# EAGLE design esp8266_programmer (EAGLE 9.2.1)
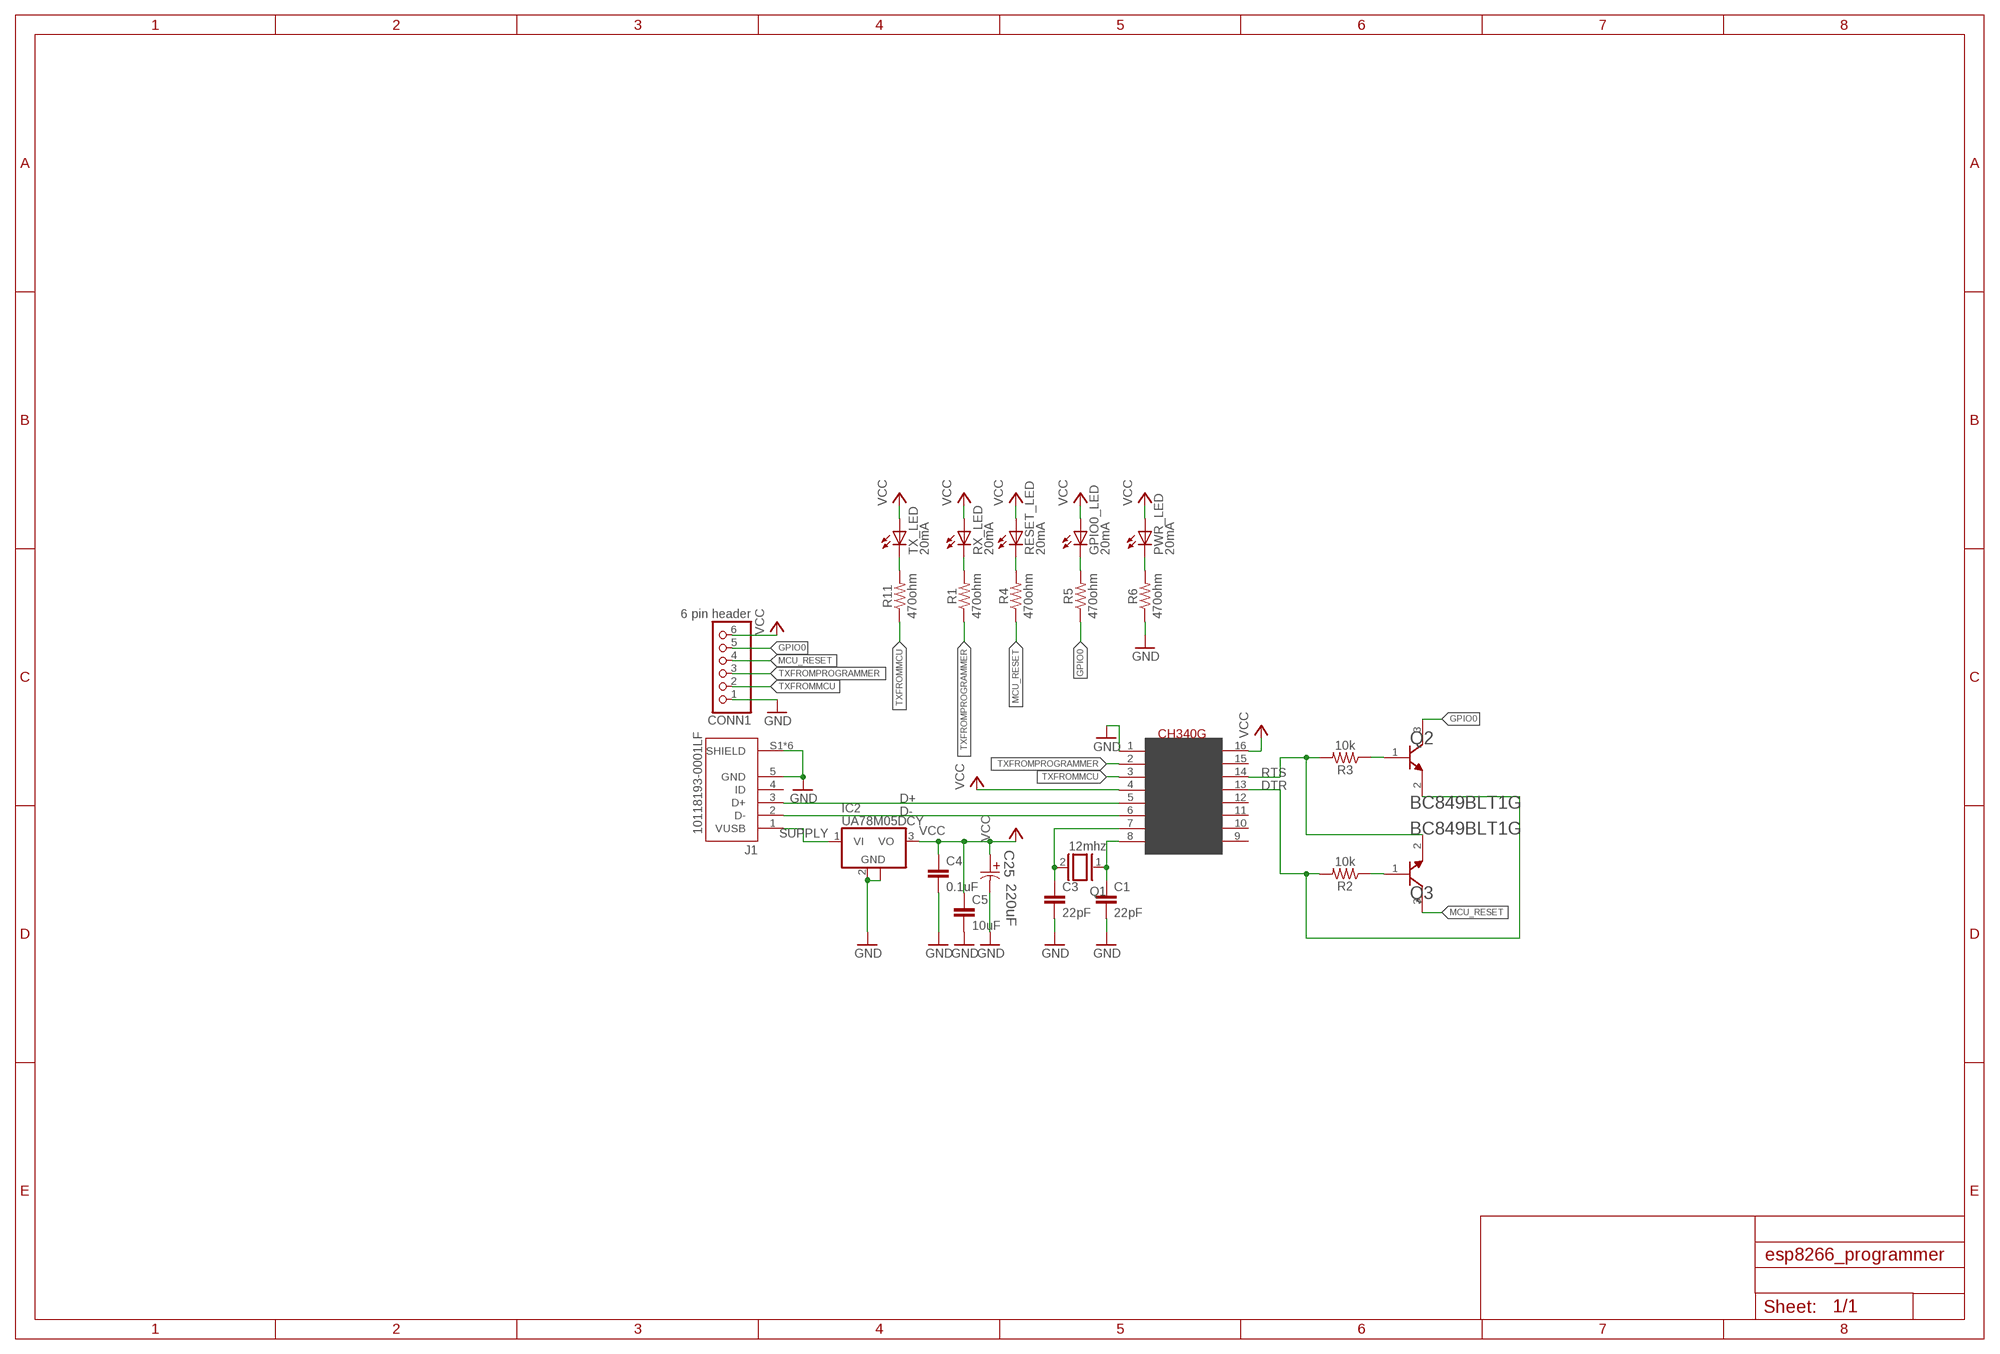
[diagram p0: schematic, sheet 1]

## Parts
C1  22pF  C-EUC0603  [C0603]
C3  22pF  C-EUC0603  [C0603]
C4  0.1uF  C-EUC0603  [C0603]
C5  10uF  C-EUC0603  [C0603]
C25  220uF  EEE-FK1C471P-CASE-F  [CAPAE830X1050N]
CONN1  6 pin header  PINHD-1X6  [1X06]
GPIO0_LED  20mA  LEDCHIP-LED0603  [CHIP-LED0603]
IC2  UA78M05DCY  [SOT223]
J1  10118193-0001LF  [FCI_10118193-0001LF]
PWR_LED  20mA  LEDCHIP-LED0603  [CHIP-LED0603]
Q1  12mhz  XTAL/S  [QS]
Q2  ON_SEMICONDUCTOR_BC849BLT1GON_SEMICONDUCTOR_BC849BLT1G_0_0  [ON_SEMICONDUCTOR_BC849BLT1G_0]
Q3  ON_SEMICONDUCTOR_BC849BLT1GON_SEMICONDUCTOR_BC849BLT1G_0_0  [ON_SEMICONDUCTOR_BC849BLT1G_0]
R1  470ohm  10KOHM-0603-1/10W-1%  [0603]
R2  10k  10KOHM-0603-1/10W-1%  [0603]
R3  10k  10KOHM-0603-1/10W-1%  [0603]
R4  470ohm  10KOHM-0603-1/10W-1%  [0603]
R5  470ohm  10KOHM-0603-1/10W-1%  [0603]
R6  470ohm  10KOHM-0603-1/10W-1%  [0603]
R11  470ohm  10KOHM-0603-1/10W-1%  [0603]
RESET_LED  20mA  LEDCHIP-LED0603  [CHIP-LED0603]
RX_LED  20mA  LEDCHIP-LED0603  [CHIP-LED0603]
TX_LED  20mA  LEDCHIP-LED0603  [CHIP-LED0603]
U$1  CH340G  [SOIC16]

## Nets
CRYSTALIN: C3.1 Q1.2 U$1.7(XI)
CRYSTALOUT: C1.1 Q1.1 U$1.8(XO)
D+: J1.3(D+) U$1.5(D+)
D-: J1.2(D-) U$1.6(D-)
DTR: Q2.2(E) R2.2 U$1.13(DTR)
GND: C1.2 C3.2 C4.2 C5.2 C25.2 CONN1.1 IC2.2(GND) IC2.4(GND) J1.5(GND) J1.S1(SHIELD) J1.S2(SHIELD) J1.S3(SHIELD) J1.S4(SHIELD) J1.S5(SHIELD) J1.S6(SHIELD) R6.1 U$1.1(GND)
GPIO0: CONN1.5 Q2.3(C) R5.1
MCU_RESET: CONN1.4 Q3.3(C) R4.1
N$3: Q3.1(B) R2.1
N$4: Q2.1(B) R3.1
RTS: Q3.2(E) R3.2 U$1.14(RTS)
STATUSTOLED: R11.2 TX_LED.C
STATUSTOLED1: R1.2 RX_LED.C
STATUSTOLED2: R4.2 RESET_LED.C
STATUSTOLED3: GPIO0_LED.C R5.2
STATUSTOLED4: PWR_LED.C R6.2
SUPPLY: IC2.1(VI) J1.1(VUSB)
TXFROMMCU: CONN1.2 R11.1 U$1.3(RX)
TXFROMPROGRAMMER: CONN1.3 R1.1 U$1.2(TX)
VCC: C4.1 C5.1 C25.1 CONN1.6 GPIO0_LED.A IC2.3(VO) PWR_LED.A RESET_LED.A RX_LED.A TX_LED.A U$1.4(V3) U$1.16(VCC)
Unconnected: J1.4(ID) U$1.9(CTS) U$1.10(DSR) U$1.11(RI) U$1.12(DCD) U$1.15(RS232)

## Library data of the parts
C1 C3-C5 = rcl:C-EU: CAPACITOR, European symbol; SPICEPREFIX: C
C25 = Panasonic-EEEFK_EEEFP:EEE-: Aluminum Electrolytic Capacitors,Surface Mount Type; MPN: EEE-FK1C471P; OC_FARNELL: 9695710; OC_NEWARK: 96K9385; PACKAGE: CASE-F; SUPPLIER: PANASONIC; TOLERANCE: ±20 %; VALUE: 470UF; VOLTAGERATING: 16V
CONN1 = adafruit:PINHD-1X6: PIN HEADER
GPIO0_LED PWR_LED RESET_LED RX_LED TX_LED = led:LED: LED OSRAM: - CHIPLED LG R971, LG N971, LY N971, LG Q971, LY Q971, LO R971, LY R971 LH N974, LH R974 LS Q976, LO Q976, LY Q976 LO Q996 - Hyper CHIPLED LW Q18S LB Q993, LB Q99A, LB R99A - SideLED LS A670, LO A670, LY A670, LG A670, LP A670 LB A673, LV A673, LT A673, LW A673 LH A674 LY A675 LS A676, LA A676, LO A676, LY A676, LW A676 LS A679, LY A679, LG A679 - Hyper Micro SIDELED® LS Y876, LA Y876, LO Y876, LY Y876 LT Y87S - SmartLED LW L88C, LW L88S LB L89C, LB L89S, LG L890 LS L89K, LO L89K, LY L89K LS L896, LA L896, LO L896, LY L896 - TOPLED LS T670, LO T670, LY T670, LG T670, LP T670 LSG T670, LSP T670, LSY T670, LOP T670, LYG T670 LG T671, LOG T671, LSG T671 LB T673, LV T673, LT T673, LW T673 LH T674 LS T676, LA T676, LO T676, LY T676, LB T676, LH T676, LSB T676, LW T676 LB T67C, LV T67C, LT T67C, LS T67K, LO T67K, LY T67K, LW E67C LS E67B, LA E67B, LO E67B, LY E67B, LB E67C, LV E67C, LT E67C LW T67C LS T679, LY T679, LG T679 LS T770, LO T770, LY T770, LG T770, LP T770 LB T773, LV T773, LT T773, LW T773 LH T774 LS E675, LA E675, LY E675, LS T675 LS T776, LA T776, LO T776, LY T776, LB T776 LHGB T686 LT T68C, LB T68C - Hyper Mini TOPLED® LB M676 - Mini TOPLED Santana® LG M470 LS M47K, LO M47K, LY M47K Source: http://www.osram.convergy.de LUXEON: - LUMILED® LXK2-PW12-R00, LXK2-PW12-S00, LXK2-PW14-U00, LXK2-PW14-V00 LXK2-PM12-R00, LXK2-PM12-S00, LXK2-PM14-U00 LXK2-PE12-Q00, LXK2-PE12-R00, LXK2-PE12-S00, LXK2-PE14-T00, LXK2-PE14-U00 LXK2-PB12-K00, LXK2-PB12-L00, LXK2-PB12-M00, LXK2-PB14-N00, LXK2-PB14-P00, LXK2-PB14-Q00 LXK2-PR12-L00, LXK2-PR12-M00, LXK2-PR14-Q00, LXK2-PR14-R00 LXK2-PD12-Q00, LXK2-PD12-R00, LXK2-PD12-S00 LXK2-PH12-R00, LXK2-PH12-S00 LXK2-PL12-P00, LXK2-PL12-Q00, LXK2-PL12-R00 Source: www.luxeon.com KINGBRIGHT: KA-3528ASYC Source: www.kingbright.com
IC2 = linear:UA78M*: POSITIVE-VOLTAGE REGULATORS Source: http://focus.ti.com/lit/ds/symlink/ua78m33.pdf
J1 = 10118193-0001LF:10118193-0001LF: Micro USB B Type Receptacle; AVAILABILITY: Unavailable; DESCRIPTION: Single Port 5 Contact Shielded SMT MICRO USB B-Type Receptacle; MF: Amphenol FCI; MP: 10118193-0001LF; PACKAGE: None; PRICE: None
Q1 = special:XTAL/S: CRYSTAL
Q2 Q3 = On Semiconductor - BC849BLT1G:ON_SEMICONDUCTOR_BC849BLT1G: ONSC-NPN-B1E2C3-3; CIIVA_IDS: 19369299; COMPONENT_LINK_1_DESCRIPTION: Manufacturer URL; COMPONENT_LINK_1_URL: http://www.onsemi.com/; COMPONENT_LINK_3_DESCRIPTION: Package Specification; COMPONENT_LINK_3_URL: http://www.onsemi.cn/pub_link/Collateral/318-08.PDF; DATASHEET: http://www.onsemi.cn/pub_link/Collateral/BC846ALT1-D.PDF; DATASHEET_VERSION: Rev. 11; FOOTPRINT_VARIANT_NAME_0: Manufacturer Recommended; FT_MIN_MHZ: 100; IC_CONTINUOUS_A: 0.1; IMPORTED: yes; IMPORTED_FROM: vault; IMPORT_TS: 1521843736; MF: On Semiconductor; MOUNTING_TECHNOLOGY: Surface Mount; MPN: BC849BLT1G; PACKAGE: SOT-23-3-318-08; PACKAGE_DESCRIPTION: 3-Pin Small Outline Transistor, Body 2.92 x 1.3 mm, Pitch 0.95 mm; PACKAGE_VERSION: Rev. AP, 11/2009; PACKING: Tape and Reel; POLARITY: NPN; PREFIX: Q; RELEASE_DATE: 1406898388; ROHS: Yes; VAULT_GUID: 19D3C7D6-08FD-4A81-9BD4-62C7617130FB; VAULT_REVISION: B4675A61-FAF7-4072-9C56-0A9635A35669
R1 R4-R6 R11 = SparkFun-Resistors:10KOHM: 10kΩ resistor A resistor is a passive two-terminal electrical component that implements electrical resistance as a circuit element. Resistors act to reduce current flow, and, at the same time, act to lower voltage levels within circuits. - Wikipedia; PROD_ID: RES-00824; VALUE: 10k
R2 R3 = SparkFun-Resistors:10KOHM: 10kΩ resistor A resistor is a passive two-terminal electrical component that implements electrical resistance as a circuit element. Resistors act to reduce current flow, and, at the same time, act to lower voltage levels within circuits. - Wikipedia; PROD_ID: RES-00824
U$1 = ch340g:CH340G

## Board
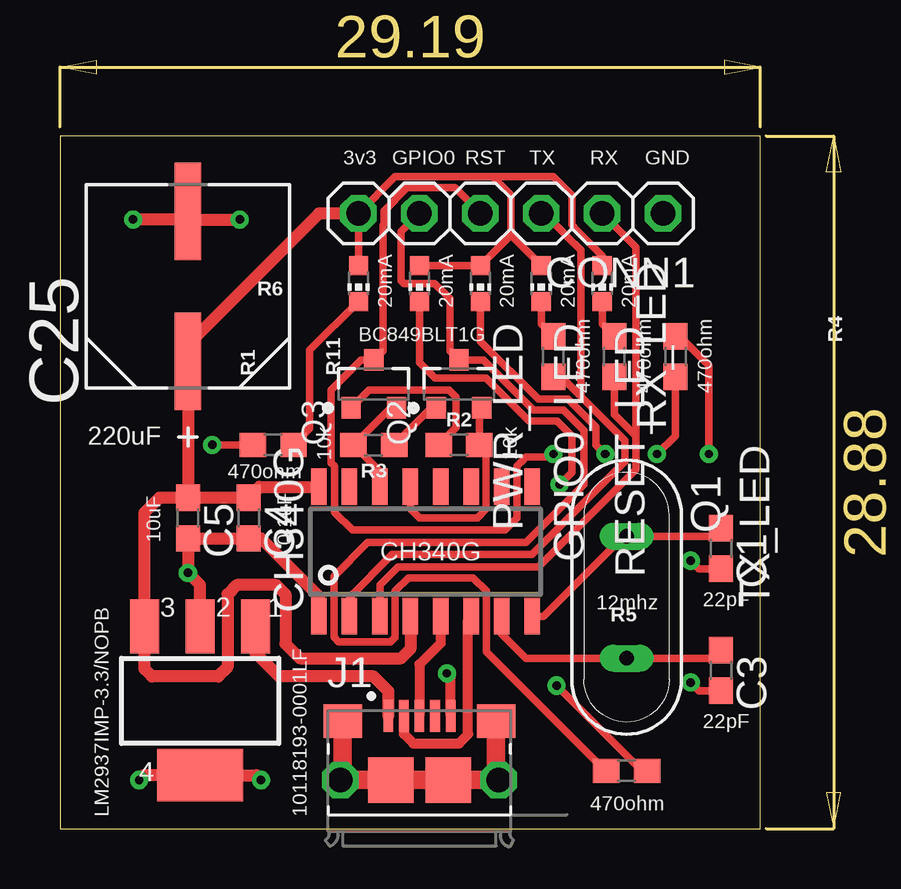
[diagram p1: board, top side]
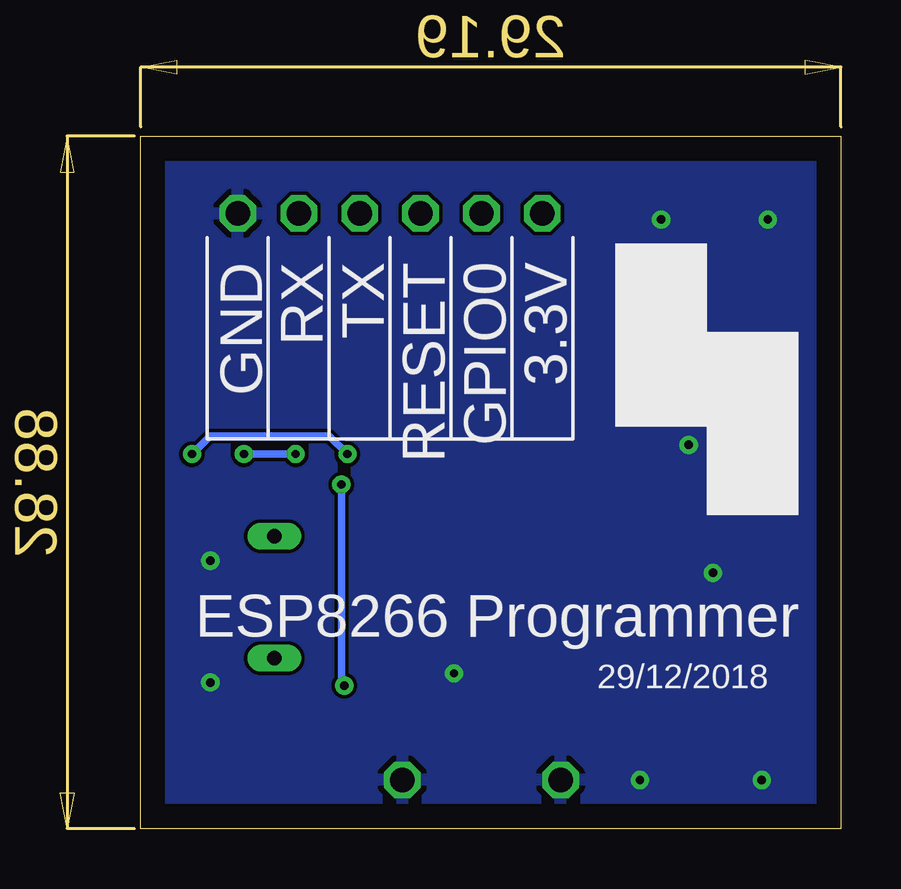
[diagram p2: board, bottom side, seen from below]

Size 29.19 x 28.88 mm. Coordinates in mm from the lower left corner, seen from the top.
Outline: 0,0 29.19,0 29.19,28.88 0,28.88 0,0
Copper layers (1*16): Top 0.035mm / dielectric 1.5mm / Bottom 0.035mm
Design rules "default": minimum track width 6mil, minimum drill 0.35mm, track to track 6mil, track to pad 6mil, pad to pad 6mil, via to via 6mil, smd to smd 6mil, copper to edge 40mil, drill to drill 6mil, minimum pad ring 10mil, minimum via ring 8mil, stop-mask expansion 4mil, vias tented up to drill 0mil, thermal gap 10mil

### Footprints (pad centres in the part's own frame; a part is rotated, then mirrored left to right if it is on the bottom)
C0603 = smd 1.1 x 1: 1 -0.85,0; 2 0.85,0
CAPAE830X1050N = smd 4.064 x 1.092: 1 -3.124,0; 2 3.124,0
1X06 = drill 1.016 octagon: 1 -6.35,0; 2 -3.81,0; 3 -1.27,0; 4 1.27,0; 5 3.81,0; 6 6.35,0
CHIP-LED0603 = smd 0.8 x 0.8: A 0,-0.75; C 0,0.75
SOT223 = smd 1.219 x 2.235: 1 -2.311,-3.099; 2 0,-3.099; 3 2.311,-3.099 | smd 3.6 x 2.2: 4 0,3.099
FCI_10118193-0001LF = smd 0.4 x 1.35: 1 -1.3,2.675; 2 -0.65,2.675; 3 0,2.675; 4 0.65,2.675; 5 1.3,2.675 | smd 1.6 x 1.4: S1 -3.2,2.45; S2 3.2,2.45 | smd 1.9 x 1.9: S3 1.2,0; S4 -1.2,0 | drill 1.016 pad 1.27 octagon: S5 -3.3,0; S6 3.3,0
QS = drill 0.61 long: 1 -2.54,0; 2 2.54,0
ON_SEMICONDUCTOR_BC849BLT1G_0 = smd 0.9 x 0.8: 1 -1,0.95; 2 -1,-0.95; 3 1,0
0603 = smd 1.1 x 1: 1 -0.85,0; 2 0.85,0
SOIC16 = smd 0.635 x 1.524: 1 -4.445,-2.695; 2 -3.175,-2.695; 3 -1.905,-2.695; 4 -0.635,-2.695; 5 0.635,-2.695; 6 1.905,-2.695; 7 3.175,-2.695; 8 4.445,-2.695; 9 4.445,2.695; 10 3.175,2.695; 11 1.905,2.695; 12 0.635,2.695; 13 -0.635,2.695; 14 -1.905,2.695; 15 -3.175,2.695; 16 -4.445,2.695

### Placement (x,y rotation side)
C1  27.56,11.68 270 top
C3  27.56,6.6 270 top
C4  7.87,12.95 270 top
C5  5.33,12.95 270 top
C25  5.33,22.61 90 top
CONN1  18.8,25.65 180 top
GPIO0_LED  14.99,22.73 180 top
IC2  5.84,5.33 180 top
J1  14.99,2.03 0 top
PWR_LED  12.45,22.73 180 top
Q1  23.62,9.65 270 top
Q2  16.64,18.54 90 top
Q3  13.08,18.54 90 top
R1  20.57,19.68 90 top
R2  16.64,16 0 top
R3  13.08,16 180 top
R4  25.65,19.68 270 top
R5  23.62,2.41 0 top
R6  8.89,16 0 top
R11  23.11,19.68 90 top
RESET_LED  17.53,22.73 180 top
RX_LED  20.07,22.73 180 top
TX_LED  22.61,22.73 180 top
U$1  15.24,11.56 0 top

### Tracks (layer width: path | path; a pad name or v marks a point on that pad's centre or on a via)
CRYSTALIN
  Top 0.305: U$1.7 18.41,8.13 19.43,7.11 Q1.2 27.22,7.11 C3.1
CRYSTALOUT
  Top 0.305: U$1.8 20.16,8.86 23.5,12.19 Q1.1 27.22,12.19 C1.1
D+
  Top 0.406: U$1.5 15.88,7.75 14.99,6.86 J1.3
D-
  Top 0.305: 17.02,8.73 U$1.6
  Top 0.406: 17.02,8.73 17.02,3.94 16.64,3.56 14.73,3.56 14.34,3.95 J1.2 14.34,4.83
DTR
  Top 0.305: Q2.2 17.49,17.44 R2.2 17.77,15.72 17.77,13.32 17.4,12.95 14.99,12.95 14.61,13.34 U$1.13
GND  (via drill 0.35)
  Top 0.305: R6.1 v6.35,16 | C1.2 26.63,10.83 v26.29,11.18 | C3.2 26.63,5.75 v26.29,6.1
  Top 0.406: J1.5 16.29,6.32 v16.13,6.48
  Top 0.508: U$1.1 10.79,9.69 8.38,12.1 C4.2 C5.2 v5.33,10.67 5.84,10.16 IC2.2 | v8.38,2.03 8.18,2.23 IC2.4 3.5,2.23 v3.3,2.03 | v7.49,25.4 5.66,25.4 C25.2 5,25.4 v3.05,25.4
  Top 0.762: J1.S1 11.79,2.13 J1.S5 J1.S4 J1.S3 J1.S6 18.19,2.13 J1.S2
  pour Bottom: 0,28.45 29.97,28.45 29.97,0.25 0,0.25
GPIO0
  Top 0.305: CONN1.5 14.22,24.89 14.22,22.86 14.35,22.73 15.62,22.73 16.26,22.1 16.26,19.92 Q2.3 17.66,19.54 19.75,17.45 21,17.45 21.84,16.6 21.84,14.35 19.43,11.94 12.83,11.94 11.42,10.53 11.42,8 11.62,7.79 13.78,7.79 13.97,7.99 13.97,9.91 14.53,10.46 17.22,10.46 17.78,9.91 17.78,7.37 22.73,2.41 R5.1
MCU_RESET  (via drill 0.35)
  Top 0.305: CONN1.4 16.46,26.72 14.48,26.72 13.51,25.76 13.51,25.21 13.46,25.16 13.46,19.92 Q3.3 12.56,19.54 11.3,18.29 11.3,15.26 11.42,15.14 11.42,15.13 11.44,15.1 11.44,13.2 12.19,12.45 18.54,12.45 19.05,12.95 19.05,15.13 19.24,15.32 19.26,15.32 19.43,15.49 20.45,15.49 v20.57,15.62 | v27.05,15.62 27.05,19.3 25.82,20.54 R4.1
  Bottom 0.305: v27.05,15.62 26.29,16.38 21.34,16.38 v20.57,15.62
N$3
  Top 0.305: R2.1 16.51,16.73 16.51,18 16.21,18.3 12.89,18.3 Q3.1
N$4
  Top 0.305: R3.1 15.47,17.54 Q2.1
RTS
  Top 0.305: U$1.14 13.34,14.9 R3.2 13.77,17.54 Q3.2
STATUSTOLED
  Top 0.305: TX_LED.C 22.61,21.04 R11.2
STATUSTOLED1
  Top 0.305: RX_LED.C 20.07,21.04 R1.2
STATUSTOLED2  (via drill 0.35)
  Top 0.305: v22.73,15.62 22.35,16 22.35,16.74 21.19,17.91 19.94,17.91 17.53,20.32 RESET_LED.C | v24.89,15.62 25.65,16.38 R4.2
  Bottom 0.305: v24.89,15.62 v22.73,15.62
STATUSTOLED3  (via drill 0.35)
  Top 0.305: GPIO0_LED.C 14.99,19.43 15.63,18.79 17.77,18.79 19.56,16.99 20.73,16.99 21.34,16.38 21.34,14.86 v20.83,14.35 | v20.7,5.97 24.26,2.41 R5.2
  Bottom 0.305: v20.83,14.35 20.83,6.1 v20.7,5.97
STATUSTOLED4
  Top 0.305: PWR_LED.C 10.41,19.95 10.41,16.68 R6.2
SUPPLY
  Top 0.508: IC2.1 8.15,7.34 9.14,6.35 13.08,6.35 13.69,5.75 J1.1
TXFROMMCU
  Top 0.305: U$1.3 13.34,10.16 14.1,10.92 19.94,10.92 24,14.99 24,16.38 | R11.1 23.11,17.27 24,16.38 | 24,16.38 24,24.26 CONN1.2
TXFROMPROGRAMMER
  Top 0.305: U$1.2 12.06,9.65 13.84,11.43 19.67,11.43 23.55,15.3 23.55,16.19 21.84,17.9 21.72,18.02 | CONN1.3 20.19,25.65 21.14,24.71 21.14,24.7 21.72,24.12 21.72,18.02 | 21.72,18.02 20.9,18.84 R1.1
VCC
  Top 0.305: 18.03,27.18 20.57,27.18 21.34,26.42 21.34,25.16 21.6,24.9 21.6,24.89 22.61,23.88 TX_LED.A | 18.03,27.18 13.97,27.18 CONN1.6 PWR_LED.A | RX_LED.A 18.8,24.75 | 18.03,27.18 18.8,26.42 18.8,24.75 | 18.8,24.75 RESET_LED.A GPIO0_LED.A
  Top 0.508: U$1.16 8.32,14.25 C4.1 C5.1 5.08,13.8 | 5.08,13.8 4.15,13.8 3.53,13.18 IC2.3 3.53,6.66 3.83,6.35 6.6,6.35 6.99,6.73 6.99,9.78 7.37,10.16 9.02,10.16 9.4,9.78 9.4,7.72 10,7.11 14.22,7.11 14.61,7.49 U$1.4 | 5.08,13.8 5.33,14.06 C25.1 5.33,20.19 10.79,25.65 CONN1.6

### Text on the board
tPlace: 3v3 | GPIO0 | RST | TX | RX | GND | 20mA | 20mA | 20mA | 20mA | 20mA | BC849BLT1G | 470ohm | 470ohm | 470ohm | 220uF | 470ohm | 10k | 10k | 10uF | 0.1uF | CH340G | 12mhz | 22pF | 22pF | LM2937IMP-3.3/NOPB | 10118193-0001LF | 470ohm
bPlace: 3.3V | GPIO0 | RESET | TX | RX | GND | ESP8266 Programmer | 29/12/2018